# Altium schematic sheet Controller[Conflict].SchDoc
size A
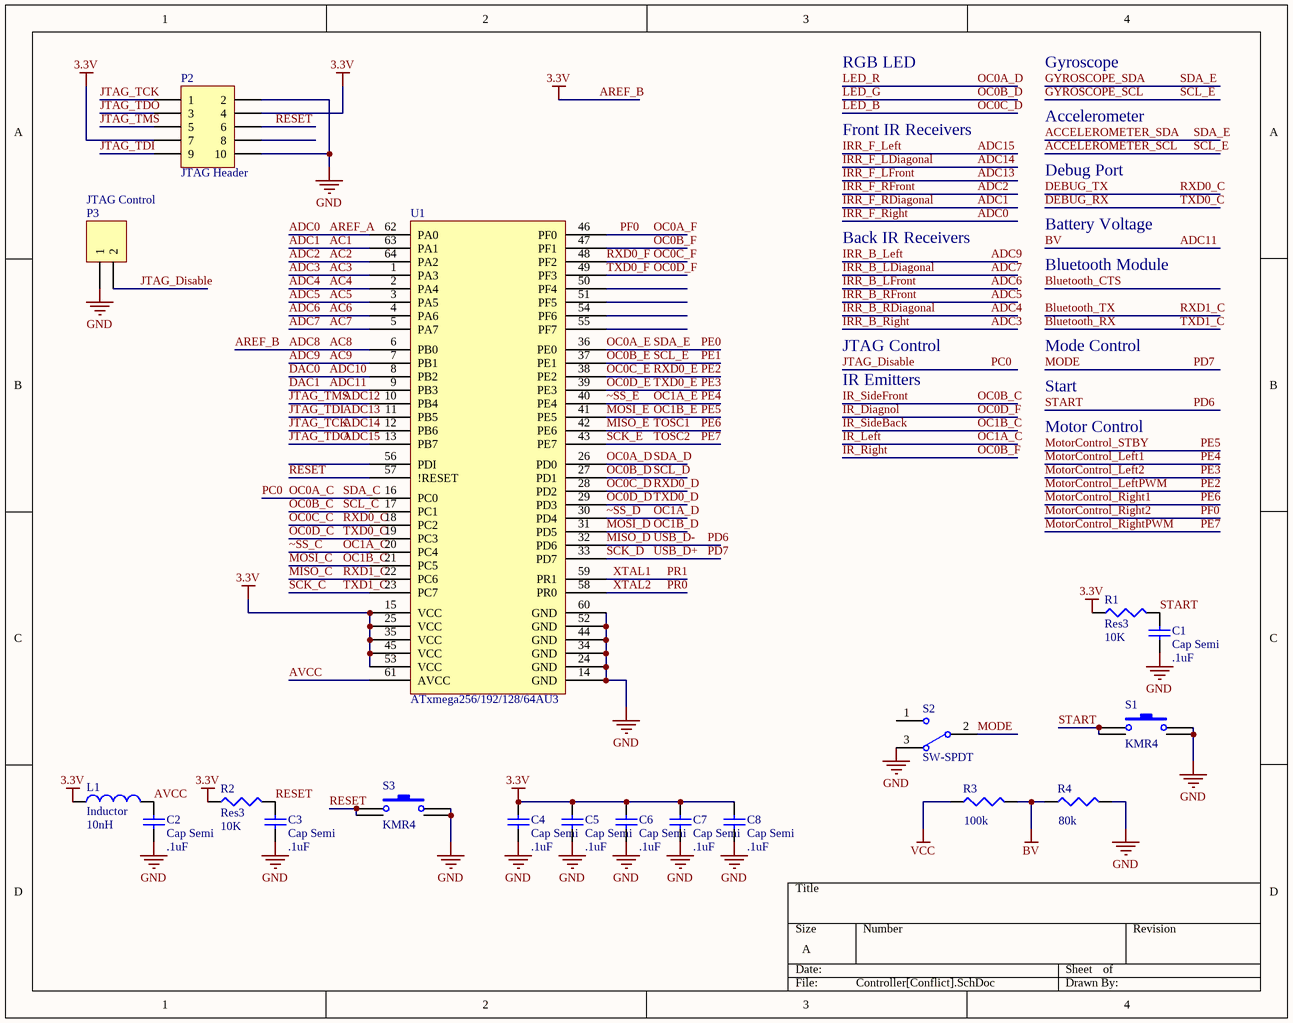
[diagram p0: Controller[Conflict].SchDoc]

## Parts
C1  Cap Semi  value .1uF  [1608[0603]]
C2  Cap Semi  value .1uF  [1608[0603]]
C3  Cap Semi  value .1uF  [1608[0603]]
C4  Cap Semi  value .1uF  [1608[0603]]
C5  Cap Semi  value .1uF  [1608[0603]]
C6  Cap Semi  value .1uF  [1608[0603]]
C7  Cap Semi  value .1uF  [1608[0603]]
C8  Cap Semi  value .1uF  [1608[0603]]
L1  Inductor  value 10nH  [INDC1608L]
P2  JTAG Header  [HDR2X5]
P3  JTAG Control  [HDR1X2]
R1  Res3  value 10K  [J1-0603]
R2  Res3  value 10K  [J1-0603]
R3  value 100k  [J1-0603]  (hidden comment: Res3)
R4  value 80k  [J1-0603]  (hidden comment: Res3)
S1  KMR4  [KMR4]
S2  SW-SPDT  [SPDT Switch]
S3  KMR4  [KMR4]
U1  ATxmega256/192/128/64AU3  [TQFP80P1600X1600X120-64N]

## Nets
AC8: C4.2 C5.2 C6.2 C7.2 C8.2 L1.1 P2.4 P2.7 R1.1 R2.1 U1.6(PB0) U1.15(VCC) U1.25(VCC) U1.35(VCC) U1.45(VCC) U1.53(VCC)  [also labelled 3.3V, ADC8, AREF_B]
ADC11: R3.2 R4.1 U1.9(PB3)  [also labelled BV, DAC1]
GND: C1.1 C2.1 C3.1 C4.1 C5.1 C6.1 C7.1 C8.1 P2.2 P2.10 P3.1 R4.2 S1.2 S1.4 S2.3 S3.2 S3.4 U1.14(GND) U1.24(GND) U1.34(GND) U1.44(GND) U1.52(GND) U1.60(GND)
VCC: R3.1
AC1: U1.63(PA1)  [also labelled ADC1, IRR_F_RDiagonal]
AC2: U1.64(PA2)  [also labelled ADC2, IRR_F_RFront]
AC3: U1.1(PA3)  [also labelled ADC3, IRR_B_Right]
AC4: U1.2(PA4)  [also labelled ADC4, IRR_B_RDiagonal]
AC5: U1.3(PA5)  [also labelled ADC5, IRR_B_RFront]
AC6: U1.4(PA6)  [also labelled ADC6, IRR_B_LFront]
AC7: U1.5(PA7)  [also labelled ADC7, IRR_B_LDiagonal]
AC9: U1.7(PB1)  [also labelled ADC9, IRR_B_Left]
ACCELEROMETER_SCL: U1.37(PE1)  [also labelled GYROSCOPE_SCL, OC0B_E, PE1, SCL_E]
ACCELEROMETER_SDA: U1.36(PE0)  [also labelled GYROSCOPE_SDA, OC0A_E, PE0, SDA_E]
ADC0: U1.62(PA0)  [also labelled AREF_A, IRR_F_Right]
ADC10: U1.8(PB2)  [also labelled DAC0]
ADC12: P2.5 U1.10(PB4)  [also labelled JTAG_TMS]
ADC13: P2.9 U1.11(PB5)  [also labelled IRR_F_LFront, JTAG_TDI]
ADC14: P2.1 U1.12(PB6)  [also labelled IRR_F_LDiagonal, JTAG_TCK]
ADC15: P2.3 U1.13(PB7)  [also labelled IRR_F_Left, JTAG_TDO]
AVCC: C2.2 L1.2 U1.61(AVCC)
Bluetooth_RX: U1.23(PC7)  [also labelled SCK_C, TXD1_C]
Bluetooth_TX: U1.22(PC6)  [also labelled MISO_C, RXD1_C]
DEBUG_RX: U1.19(PC3)  [also labelled OC0D_C, TXD0_C]
DEBUG_TX: U1.18(PC2)  [also labelled OC0C_C, RXD0_C]
IR_Diagnol: U1.49(PF3)  [also labelled OC0D_F, TXD0_F]
IR_Left: U1.20(PC4)  [also labelled OC1A_C, ~SS_C]
IR_Right: U1.47(PF1)  [also labelled OC0B_F]
IR_SideBack: U1.21(PC5)  [also labelled MOSI_C, OC1B_C]
IR_SideFront: U1.17(PC1)  [also labelled OC0B_C, SCL_C]
JTAG_Disable: P3.2 U1.16(PC0)  [also labelled OC0A_C, PC0, SDA_C]
LED_B: U1.28(PD2)  [also labelled OC0C_D, RXD0_D]
LED_G: U1.27(PD1)  [also labelled OC0B_D, SCL_D]
LED_R: U1.26(PD0)  [also labelled OC0A_D, SDA_D]
MISO_D: C1.2 R1.2 S1.1 S1.3 U1.32(PD6)  [also labelled PD6, START, USB_D-]
MISO_E: U1.42(PE6)  [also labelled MotorControl_Right1, PE6, TOSC1]
MODE: S2.2 U1.33(PD7)  [also labelled PD7, SCK_D, USB_D+]
MOSI_D: U1.31(PD5)  [also labelled OC1B_D]
MOSI_E: U1.41(PE5)  [also labelled MotorControl_STBY, OC1B_E, PE5]
MotorControl_Left1: U1.40(PE4)  [also labelled OC1A_E, PE4, ~SS_E]
MotorControl_Left2: U1.39(PE3)  [also labelled OC0D_E, PE3, TXD0_E]
MotorControl_LeftPWM: U1.38(PE2)  [also labelled OC0C_E, PE2, RXD0_E]
MotorControl_Right2: U1.46(PF0)  [also labelled OC0A_F, PF0]
MotorControl_RightPWM: U1.43(PE7)  [also labelled PE7, SCK_E, TOSC2]
OC0C_F: U1.48(PF2)  [also labelled RXD0_F]
OC0D_D: U1.29(PD3)  [also labelled TXD0_D]
OC1A_D: U1.30(PD4)  [also labelled ~SS_D]
PR0: U1.58(PR0)  [also labelled XTAL2]
PR1: U1.59(PR1)  [also labelled XTAL1]
RESET: C3.2 P2.6 R2.2 S3.1 S3.3 U1.57(!RESET)

Not connected (* = marked no-connect by the designer): P2 8; S2 1; U1 50(PF4) 51(PF5) 54(PF6) 55(PF7) 56(PDI)

## Notes on the sheet
- RGB LED
- Gyroscope
- Front IR Receivers
- Accelerometer
- Debug Port
- Battery Voltage
- Back IR Receivers
- Bluetooth Module
- JTAG Control
- Mode Control
- IR Emitters
- Start
- Motor Control

## Library data of the parts
C1-C8 = Cap Semi: Capacitor (Semiconductor SIM Model); Published: 8-Jun-2000; LatestRevisionDate: 29-May-2009; LatestRevisionNote: IPC-7351 Footprint Added.; PackageReference: C1206; Publisher: Altium Limited; PackageDescription: Chip Capacitor
L1 = Inductor: Code_IEC: 1005; Published: 8-Jun-2000; LatestRevisionDate: 29-May-2009; LatestRevisionNote: IPC-7351 Footprint Added.; PackageReference: 0402-A; Publisher: Altium Limited; PackageDescription: Chip Inductor; Code_JEITA: 0402
P2 = Header 5X2: Header, 5-Pin, Dual row; LatestRevisionDate: 17-Jul-2002; LatestRevisionNote: Re-released for DXP Platform.; Publisher: Altium Limited
P3 = Header 2: Header, 2-Pin; LatestRevisionDate: 17-Jul-2002; LatestRevisionNote: Re-released for DXP Platform.; Publisher: Altium Limited
R1-R4 = Res3: Resistor; Published: 8-Jun-2000; LatestRevisionDate: 29-May-2009; LatestRevisionNote: IPC-7351 Footprint Added.; PackageReference: J1-0603; Publisher: Altium Limited; PackageDescription: Chip Resistor
S1 S3 = SPST Tactile Switch: Switch; Published: 24-Mar-1999; LatestRevisionDate: 17-Jul-2002; LatestRevisionNote: Re-released for DXP Platform.; PackageReference: SPST-2; Publisher: Altium Limited
S2 = SW-SPDT: SPDT Subminiature Toggle Switch, Right Angle Mounting, Vertical Actuation; Published: 24-Mar-1999; LatestRevisionDate: 17-Dec-2003; LatestRevisionNote: Schematic revised, PCB Footprint replaced.; DatasheetVersion: 05-Dec-2000; PackageReference: TL36WW15050; Publisher: Altium Limited; PackageDescription: Switch; 4 Leads; ComponentLink1Description: Manufacturer Link; ComponentLink1URL: http://www.apem.com
U1 = ATxmega256/192/128/64A3U